# Altium schematic sheet 智能家居-电灯-主控板.SchDoc
size A4
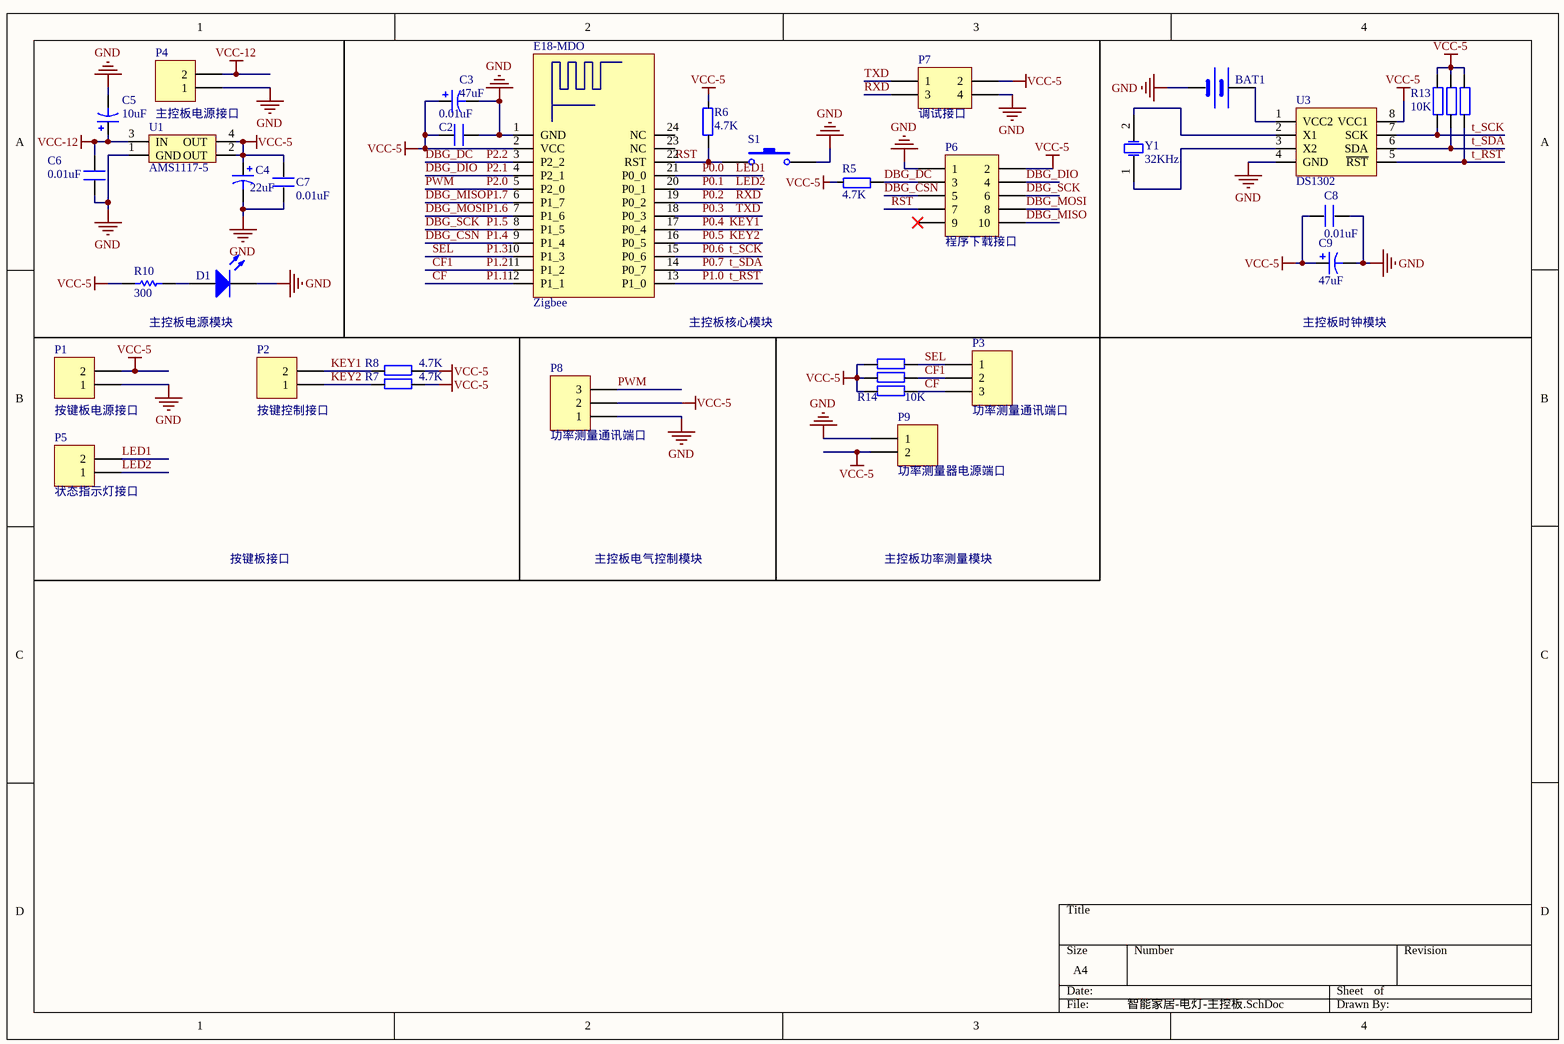
[diagram p0: 智能家居-电灯-主控板.SchDoc]

## Parts
BAT1  BATT  [BATM]  (value not drawn)
C2  0.01uF  [0.1UF]
C3  value 47uF  [CD5]  (hidden comment: Cap Pol1)
C4  value 22uF  [CD5]  (hidden comment: Cap Pol1)
C5  value 10uF  [CD5]  (hidden comment: Cap Pol1)
C6  0.01uF  [0.1UF]
C7  0.01uF  [0.1UF]
C8  0.01uF  [0.1UF]
C9  value 47uF  [CD5]  (hidden comment: Cap Pol1)
D1  LED0  [LED-3]  (value not drawn)
E18-MDO  Zigbee  [E18-MD0-1]
P1  按键板电源接口  [DG1282]
P2  按键控制接口  [DG1282]
P3  功率测量通讯端口  [DG1283]
P4  主控板电源接口  [DG1282]
P5  状态指示灯接口  [DG1282]
P6  程序下载接口  [HDR2X5]
P7  调试接口  [HDR2X2]
P8  功率测量通讯端口  [DG1283]
P9  功率测量器电源端口  [DG1282]
R5  4.7K  [AXIAL-0.3]
R6  4.7K  [AXIAL-0.3]
R7  4.7K  [AXIAL-0.3]
R8  4.7K  [AXIAL-0.3]
R10  value 300  [AXIAL-0.3]  (hidden comment: Res1)
R11  10K  [AXIAL-0.3]  (value not drawn)
R12  10K  [AXIAL-0.3]  (value not drawn)
R13  10K  [AXIAL-0.3]
R14  10K  [AXIAL-0.3]
R15  10K  [AXIAL-0.3]  (value not drawn)
R16  10K  [AXIAL-0.3]  (value not drawn)
S1  SW-PB  [KEY_M]  (value not drawn)
U1  AMS1117-5  [AMS1117]
U3  DS1302  [DIP-8N]
Y1  32KHz  [3216]

## Nets
GND: BAT1.2(GND) C2.2 C3.2 C4.2 C5.2 C6.1 C7.1 C8.2 C9.2 D1.2(K) E18-MDO.1(GND) P1.1 P4.1 P6.1 P7.4 P8.1 P9.1 S1.2 U1.1(GND) U3.4(GND)
VCC-5: C2.1 C3.1 C4.1 C7.2 C8.1 C9.1 E18-MDO.2(VCC) P1.2 P6.2 P7.2 P8.2 P9.2 R5.1 R6.1 R7.1 R8.1 R10.1 R11.2 R12.2 R13.2 R14.2 R15.2 R16.2 U1.2(OUT) U1.4(OUT) U3.8(VCC1)
VCC-12: C5.1 C6.2 P4.2 U1.3(IN)
CF: E18-MDO.12(P1_1) P3.3 R14.1  [also labelled P1.1]
CF1: E18-MDO.11(P1_2) P3.2 R15.1  [also labelled P1.2]
DBG_CSN: E18-MDO.9(P1_4) P6.5  [also labelled P1.4]
DBG_DC: E18-MDO.3(P2_2) P6.3 R5.2  [also labelled P2.2]
DBG_DIO: E18-MDO.4(P2_1) P6.4  [also labelled P2.1]
DBG_MISO: E18-MDO.6(P1_7) P6.10  [also labelled P1.7]
DBG_MOSI: E18-MDO.7(P1_6) P6.8  [also labelled P1.6]
DBG_SCK: E18-MDO.8(P1_5) P6.6  [also labelled P1.5]
KEY1: E18-MDO.17(P0_4) P2.2 R8.2  [also labelled P0.4]
KEY2: E18-MDO.16(P0_5) P2.1 R7.2  [also labelled P0.5]
LED1: E18-MDO.21(P0_0) P5.2  [also labelled P0.0]
LED2: E18-MDO.20(P0_1) P5.1  [also labelled P0.1]
P0.2: E18-MDO.19(P0_2) P7.3  [also labelled RXD]
P0.3: E18-MDO.18(P0_3) P7.1  [also labelled TXD]
P0.6: E18-MDO.15(P0_6) R13.1 U3.7(SCK)  [also labelled t_SCK]
P0.7: E18-MDO.14(P0_7) R12.1 U3.6(SDA)  [also labelled t_SDA]
P1.0: E18-MDO.13(P1_0) R11.1 U3.5(~{RST})  [also labelled t_RST]
P1.3: E18-MDO.10(P1_3) P3.1 R16.1  [also labelled SEL]
P2.0: E18-MDO.5(P2_0) P8.3  [also labelled PWM]
RST: E18-MDO.22(RST) P6.7 R6.2 S1.1
NetBAT1_1: BAT1.1(VCC) U3.1(VCC2)
NetD1_1: D1.1(A) R10.2
NetU3_2: U3.2(X1) Y1.2(OSC2)
NetU3_3: U3.3(X2) Y1.1(OSC1)

Not connected (* = marked no-connect by the designer): E18-MDO 23(NC) 24(NC); P6 9*

## Notes on the sheet
- 主控板电源模块
- (near E18-MDO) 主控板核心模块
- 主控板时钟模块
- 按键板接口
- 主控板电气控制模块
- 主控板功率测量模块

## Library data of the parts
BAT1 = BAT
C2 C6-C8 = C
C3-C5 C9 = Cap Pol1: Polarized Capacitor (Radial); Published: 8-Jun-2000; LatestRevisionDate: 17-Jul-2002; LatestRevisionNote: Re-released for DXP Platform.; PackageReference: RB7.6-15; Publisher: Altium Limited; PackageDescription: Polarized Capacitor (Radial); 2 Leads
D1 = LED0: Typical INFRARED GaAs LED; Published: 8-Jun-2000; LatestRevisionDate: 08-Jul-2005; LatestRevisionNote: Mech Layer 1 removed.; PackageReference: LED-0; Publisher: Altium Limited; PackageDescription: LED; 2 Leads
E18-MDO = E18-MDO: Zigbee模块
P1 P2 P4 P5 P9 = Header 2H: Header, 2-Pin, Right Angle; LatestRevisionDate: 17-Jul-2002; LatestRevisionNote: Re-released for DXP Platform.; Publisher: Altium Limited
P3 P8 = Header 3: Header, 3-Pin; LatestRevisionDate: 17-Jul-2002; LatestRevisionNote: Re-released for DXP Platform.; Publisher: Altium Limited
P6 = Header 5X2: Header, 5-Pin, Dual row; LatestRevisionDate: 17-Jul-2002; LatestRevisionNote: Re-released for DXP Platform.; Publisher: Altium Limited
P7 = Header 2X2H: Header, 2-Pin, Dual row, Right Angle; LatestRevisionDate: 17-Jul-2002; LatestRevisionNote: Re-released for DXP Platform.; Publisher: Altium Limited
R5-R8 R11-R16 = R
R10 = Res1: Resistor; Published: 8-Jun-2000; LatestRevisionDate: 17-Jul-2002; LatestRevisionNote: Re-released for DXP Platform.; PackageReference: AXIAL-0.3; Publisher: Altium Limited; PackageDescription: Axial Device, Thru-Hole; 2 Leads; 0.3 in Pin Spacing
S1 = SW-PB: Switch; Published: 24-Mar-1999; LatestRevisionDate: 17-Jul-2002; LatestRevisionNote: Re-released for DXP Platform.; PackageReference: SPST-2; Publisher: Altium Limited; PackageDescription: Switch; 2 Leads
U1 = AMS1117
Y1 = XTAL: Crystal Oscillator; Published: 8-Jun-2000; LatestRevisionDate: 17-Jul-2002; LatestRevisionNote: Re-released for DXP Platform.; PackageReference: R38; Publisher: Altium Limited; PackageDescription: Crystal, Thru-Hole; 2 Leads; Body 3.1 x 8.2 mm (Dia.xH)